# Altium project 远程医疗.PrjPCB
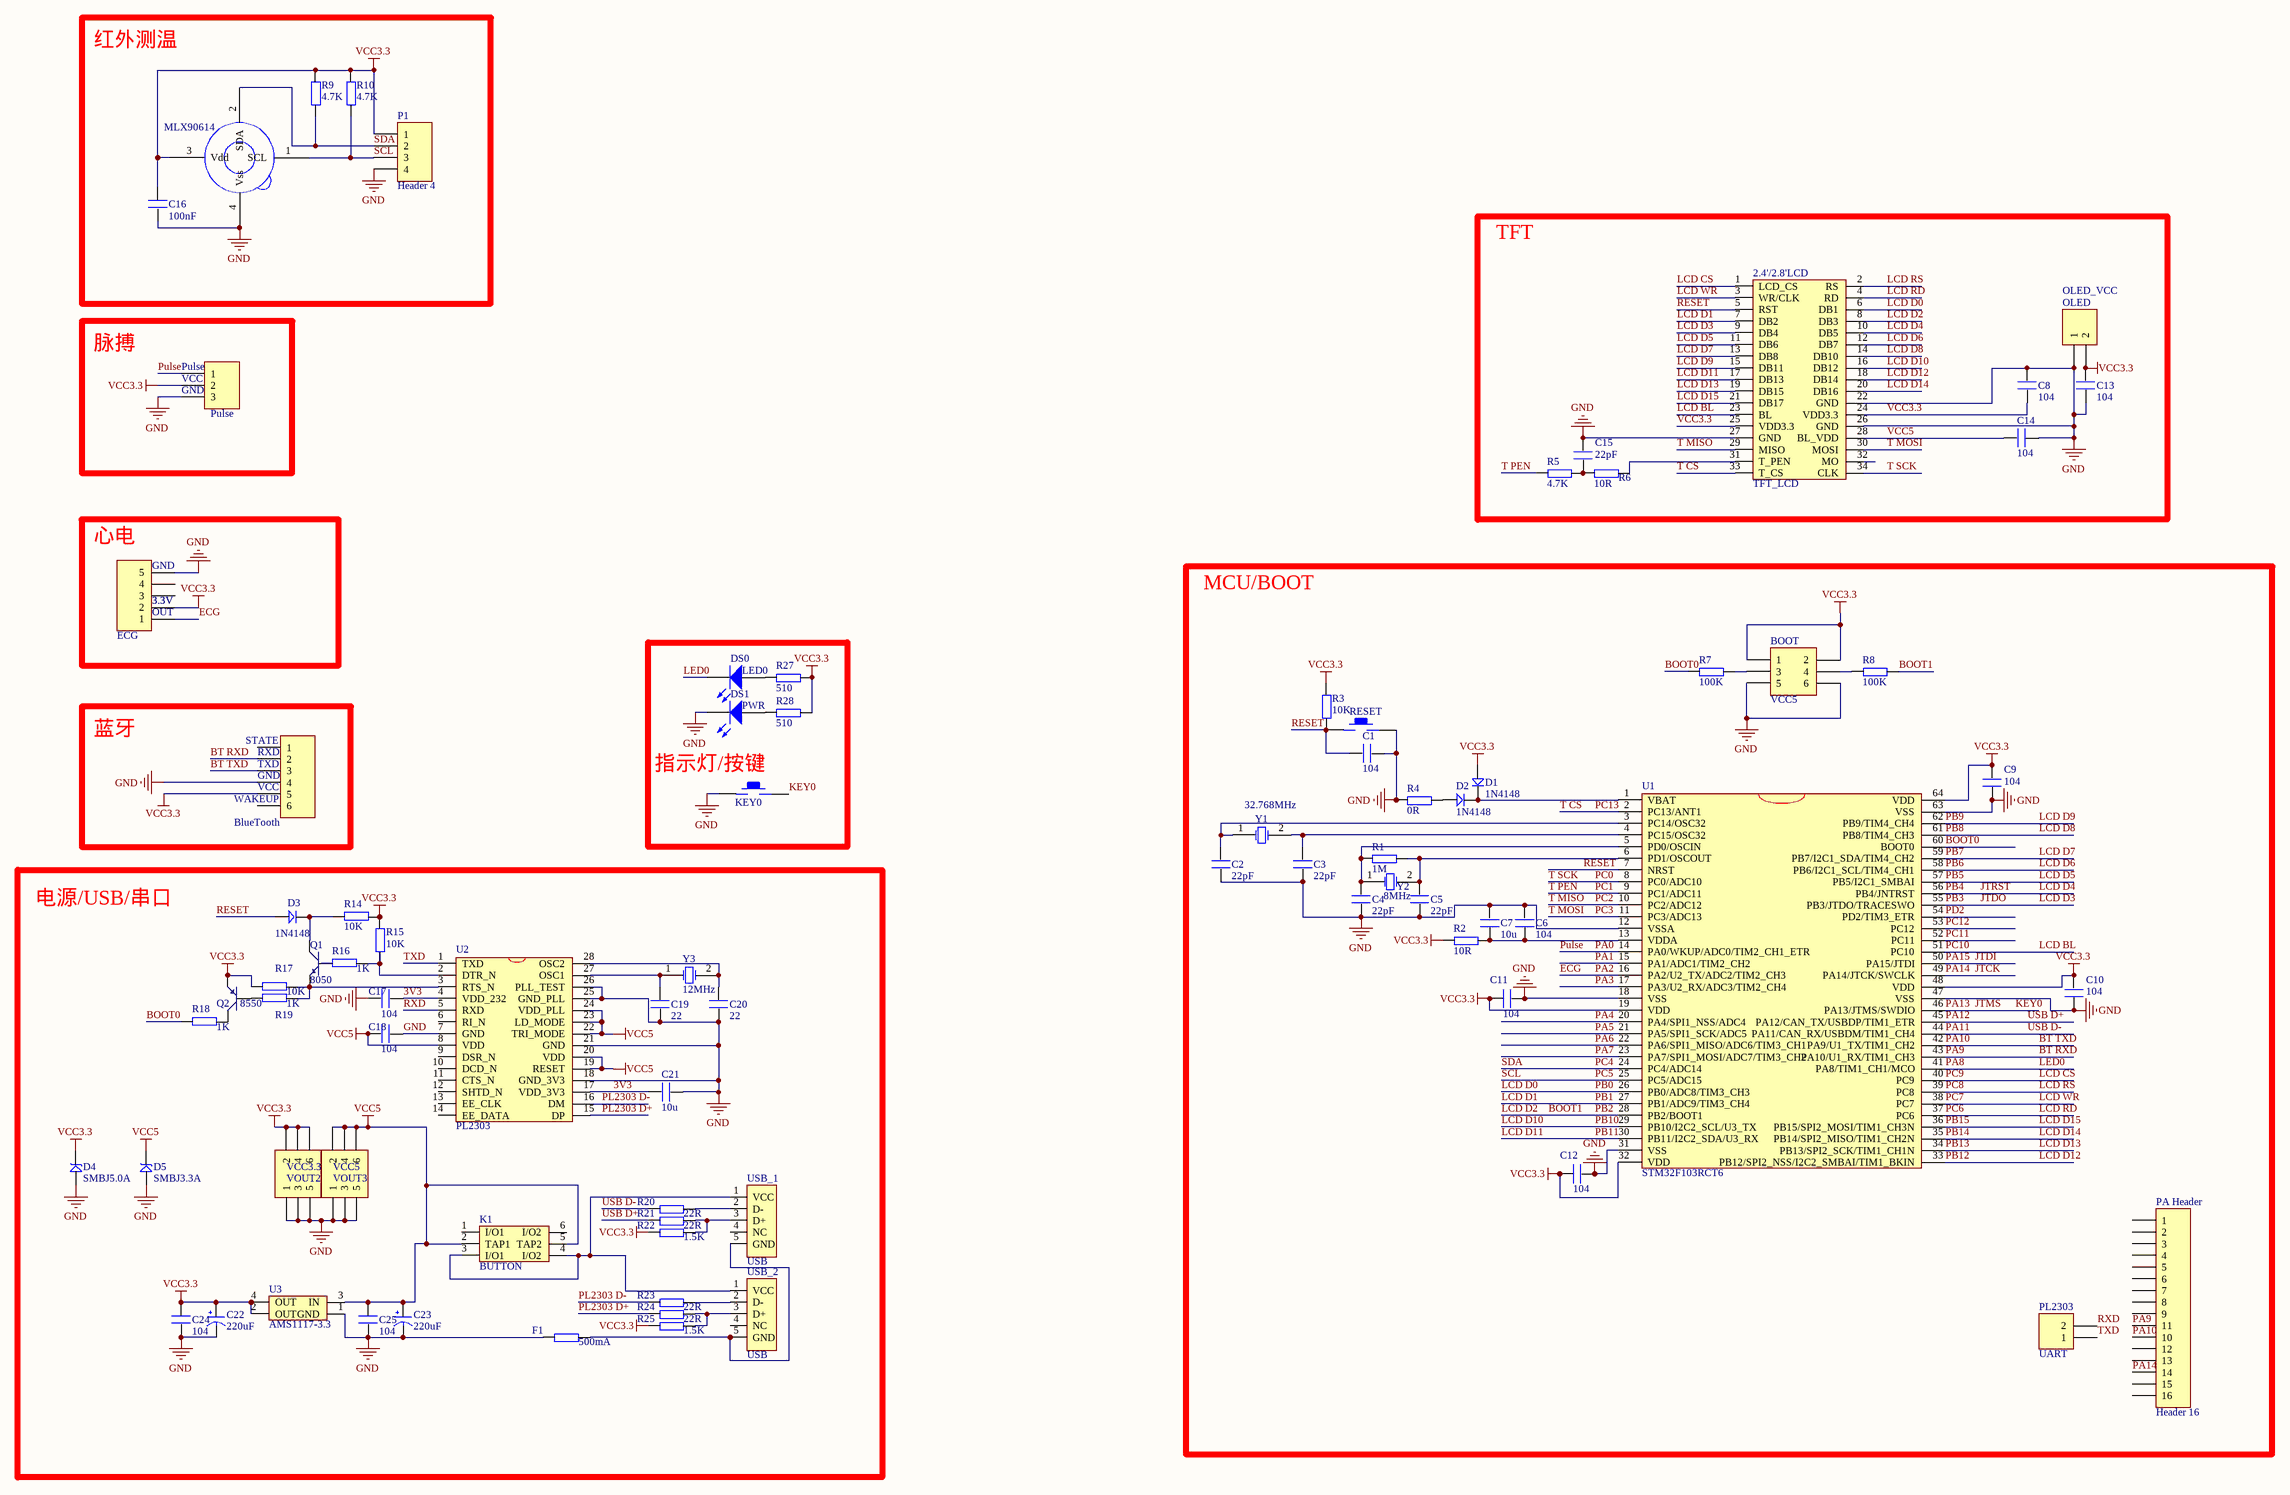
[diagram p0: 远程医疗.SchDoc]
1 sheet, 82 parts. Net scope: global (net labels, ports and power ports of the same name join across sheets).
Board file: 远程医疗完成2014-11-06.PcbDoc

## Sheet 远程医疗.SchDoc
size C

### Parts
2.4'/2.8'LCD  TFT_LCD  [DB2*17]
BlueTooth  BlueTooth  [BlueTooth]  (value not drawn)
BOOT  VCC5  [HDR2X3]
C1  104  [0603P]
C2  22pF  [0603P]
C3  22pF  [0603P]
C4  22pF  [0603P]
C5  22pF  [0603P]
C6  104  [0603P]
C7  10u  [0603P]
C8  104  [0603P]
C9  104  [0603P]
C10  104  [0603P]
C11  104  [0603P]
C12  104  [0603P]
C13  104  [0603P]
C14  104  [0603P]
C15  22pF  [0603P]
C16  100nF  [0603P]
C17  104  [0603P]
C18  104  [0603P]
C19  22  [0603P]
C20  22  [0603P]
C21  10u  [0603P]
C22  220uF  [CC6.56.5]
C23  220uF  [CC6.56.5]
C24  104  [0603P]
C25  104  [0603P]
D1  1N4148  [DIODE_SOP]
D2  1N4148  [DIODE_SOP]
D3  1N4148  [DIODE_SOP]
D4  SMBJ5.0A  [SMBJ]
D5  SMBJ3.3A  [SMBJ]
DS0  LED0  [SMDLED]
DS1  PWR  [SMDLED]
ECG  ECG  [ECG]  (value not drawn)
F1  500mA  [0603P]
K1  BUTTON  [BTN8.5*8.5]
KEY0  KEY_M  [KEY_M]  (value not drawn)
MLX90614  MLX90614  [MLX90614]  (value not drawn)
OLED  OLED_VCC  [HDR1X2]
P1  Header 4  [HDR1X4]
PA_Header  Header 16  [HDR1X16]
PL2303  UART  [HDR1X2]
Pulse  Pulse  [Pulse]  (value not drawn)
Q1  8050  [SOT-23R]
Q2  8550  [SOT-23R]
R1  1M  [0603P]
R2  10R  [0603P]
R3  10K  [0603P]
R4  0R  [0603P]
R5  4.7K  [0603P]
R6  10R  [0603P]
R7  100K  [0603P]
R8  100K  [0603P]
R9  4.7K  [0603P]
R10  4.7K  [0603P]
R14  10K  [0603P]
R15  10K  [0603P]
R16  1K  [0603P]
R17  10K  [0603P]
R18  1K  [0603P]
R19  1K  [0603P]
R20  22R  [0603P]
R21  22R  [0603P]
R22  1.5K  [0603P]
R23  22R  [0603P]
R24  22R  [0603P]
R25  1.5K  [0603P]
R27  510  [0603P]
R28  510  [0603P]
RESET  KEY_M  [KEY_M]  (value not drawn)
U1  STM32F103RCT6  [LQFP64]
U2  PL2303  [ssop28]
U3  AMS1117-3.3  [AMS1117]
USB_1  USB  [USB/SM0.8-6H5]
USB_2  USB  [USB/SM0.8-6H5]
VOUT2  VCC3.3  [HDR2X3]
VOUT3  VCC5  [HDR2X3]
Y1  32.768MHz  [XTAL 32M]
Y2  8MHz  [XTAL_US]
Y3  12MHz  [XTAL_US]

### Blocks framed on the sheet
红外测温: C16 MLX90614 P1 R9 R10
TFT: 2.4'/2.8'LCD C8 C13-C15 OLED R5 R6
脉搏: Pulse
心电: ECG
MCU/BOOT: BOOT C1-C7 C9-C12 D1 D2 PA_Header PL2303 R1-R4 R7 R8 RESET U1 Y1 Y2
指示灯/按键: DS0 DS1 KEY0 R27 R28
蓝牙: BlueTooth
电源/USB/串口: C17-C25 D3-D5 F1 K1 Q1 Q2 R14-R25 U2 U3 USB_1 USB_2 VOUT2 VOUT3 Y3

### Nets
GND: 2.4'/2.8'LCD.22(GND) 2.4'/2.8'LCD.26(GND) 2.4'/2.8'LCD.27(GND) BlueTooth.4 BOOT.5 BOOT.6 C1.1 C2.1 C3.1 C4.1 C5.1 C6.1 C7.1 C8.2 C9.2 C10.2 C11.2 C12.2 C13.1 C14.1 C15.2 C16.1 C17.1 C18.2 C19.1 C20.1 C21.1 C22.2(GND) C23.2(GND) C24.1 C25.1 D4.1 D5.1 DS1.2(K) ECG.5 F1.1 KEY0.1 MLX90614.4(Vss) OLED.1 P1.4 Pulse.3 R4.1 RESET.2 U1.12(VSSA) U1.18(VSS) U1.31(VSS) U1.47(VSS) U1.63(VSS) U2.7(GND) U2.18(GND_3V3) U2.21(GND) U2.25(GND_PLL) U2.26(PLL_TEST) U3.1(GND) VOUT2.1 VOUT2.3 VOUT2.5 VOUT3.1 VOUT3.3 VOUT3.5
VCC3.3: 2.4'/2.8'LCD.24(VDD3.3) 2.4'/2.8'LCD.25(VDD3.3) BlueTooth.5 BOOT.1 BOOT.2 C8.1 C9.1 C10.1 C11.1 C12.1 C13.2 C16.2 C22.1(VCC) C24.2 D1.1 D4.2 ECG.2 MLX90614.3(Vdd) OLED.2 P1.1 Pulse.2 Q2.1(E) R2.1 R3.2 R9.2 R10.2 R14.1 R15.2 R17.2 R22.1 R25.1 R27.2 R28.2 U1.19(VDD) U1.32(VDD) U1.48(VDD) U1.64(VDD) U3.2(OUT) U3.4(OUT) VOUT2.2 VOUT2.4 VOUT2.6
VCC5: 2.4'/2.8'LCD.28(BL_VDD) C14.2 C18.1 C23.1(VCC) C25.2 D5.2 K1.2(TAP1) K1.5(TAP2) U2.8(VDD) U2.19(RESET) U2.20(VDD) U2.22(TRI_MODE) U2.23(LD_MODE) U2.24(VDD_PLL) U3.3(IN) VOUT3.2 VOUT3.4 VOUT3.6
3V3: C17.2 C21.2 U2.4(VDD_232) U2.17(VDD_3V3)
BOOT0: R7.1 R18.2 U1.60(BOOT0)
BOOT1: 2.4'/2.8'LCD.8(DB3) R8.2 U1.28(PB2/BOOT1)  [also labelled LCD D2, PB2]
BT RXD: BlueTooth.2 PA_Header.11 U1.43(PA10/U1_RX/TIM1_CH3)  [also labelled PA9]
BT TXD: BlueTooth.3 PA_Header.10 U1.42(PA9/U1_TX/TIM1_CH2)  [also labelled PA10]
ECG: ECG.1 U1.16(PA2/U2_TX/ADC2/TIM2_CH3)  [also labelled PA2]
JTCK: PA_Header.14 U1.49(PA14/JTCK/SWCLK)  [also labelled PA14]
JTDI: U1.50(PA15/JTDI)  [also labelled PA15]
JTDO: 2.4'/2.8'LCD.9(DB4) U1.55(PB3/JTDO/TRACESWO)  [also labelled LCD D3, PB3]
JTMS: KEY0.2 U1.46(PA13/JTMS/SWDIO)  [also labelled KEY0, PA13]
JTRST: 2.4'/2.8'LCD.10(DB5) U1.56(PB4/JNTRST)  [also labelled LCD D4, PB4]
LCD BL: 2.4'/2.8'LCD.23(BL) U1.51(PC10)  [also labelled PC10]
LCD CS: 2.4'/2.8'LCD.1(LCD_CS) U1.40(PC9)  [also labelled PC9]
LCD D0: 2.4'/2.8'LCD.6(DB1) U1.26(PB0/ADC8/TIM3_CH3)  [also labelled PB0]
LCD D1: 2.4'/2.8'LCD.7(DB2) U1.27(PB1/ADC9/TIM3_CH4)  [also labelled PB1]
LCD D5: 2.4'/2.8'LCD.11(DB6) U1.57(PB5/I2C1_SMBAI)  [also labelled PB5]
LCD D6: 2.4'/2.8'LCD.12(DB7) U1.58(PB6/I2C1_SCL/TIM4_CH1)  [also labelled PB6]
LCD D7: 2.4'/2.8'LCD.13(DB8) U1.59(PB7/I2C1_SDA/TIM4_CH2)  [also labelled PB7]
LCD D8: 2.4'/2.8'LCD.14(DB10) U1.61(PB8/TIM4_CH3)  [also labelled PB8]
LCD D9: 2.4'/2.8'LCD.15(DB11) U1.62(PB9/TIM4_CH4)  [also labelled PB9]
LCD D10: 2.4'/2.8'LCD.16(DB12) U1.29(PB10/I2C2_SCL/U3_TX)  [also labelled PB10]
LCD D11: 2.4'/2.8'LCD.17(DB13) U1.30(PB11/I2C2_SDA/U3_RX)  [also labelled PB11]
LCD D12: 2.4'/2.8'LCD.18(DB14) U1.33(PB12/SPI2_NSS/I2C2_SMBAI/TIM1_BKIN)  [also labelled PB12]
LCD D13: 2.4'/2.8'LCD.19(DB15) U1.34(PB13/SPI2_SCK/TIM1_CH1N)  [also labelled PB13]
LCD D14: 2.4'/2.8'LCD.20(DB16) U1.35(PB14/SPI2_MISO/TIM1_CH2N)  [also labelled PB14]
LCD D15: 2.4'/2.8'LCD.21(DB17) U1.36(PB15/SPI2_MOSI/TIM1_CH3N)  [also labelled PB15]
LCD RD: 2.4'/2.8'LCD.4(RD) U1.37(PC6)  [also labelled PC6]
LCD RS: 2.4'/2.8'LCD.2(RS) U1.39(PC8)  [also labelled PC8]
LCD WR: 2.4'/2.8'LCD.3(WR/CLK) U1.38(PC7)  [also labelled PC7]
LED0: DS0.2(K) U1.41(PA8/TIM1_CH1/MCO)  [also labelled PA8]
PA0: Pulse.1 U1.14(PA0/WKUP/ADC0/TIM2_CH1_ETR)  [also labelled Pulse]
PA1: U1.15(PA1/ADC1/TIM2_CH2)
PA3: U1.17(PA3/U2_RX/ADC3/TIM2_CH4)
PA4: U1.20(PA4/SPI1_NSS/ADC4)
PA5: U1.21(PA5/SPI1_SCK/ADC5)
PA6: U1.22(PA6/SPI1_MISO/ADC6/TIM3_CH1)
PA7: U1.23(PA7/SPI1_MOSI/ADC7/TIM3_CH2)
PA11: R20.1 U1.44(PA11/CAN_RX/USBDM/TIM1_CH4)  [also labelled USB D-]
PA12: R21.1 U1.45(PA12/CAN_TX/USBDP/TIM1_ETR)  [also labelled USB D+]
PC0: 2.4'/2.8'LCD.34(CLK) U1.8(PC0/ADC10)  [also labelled T SCK]
PC1: R5.1 U1.9(PC1/ADC11)  [also labelled T PEN]
PC2: 2.4'/2.8'LCD.29(MISO) U1.10(PC2/ADC12)  [also labelled T MISO]
PC3: 2.4'/2.8'LCD.30(MOSI) U1.11(PC3/ADC13)  [also labelled T MOSI]
PC4: MLX90614.2(SDA) P1.2 R9.1 U1.24(PC4/ADC14)  [also labelled SDA]
PC5: MLX90614.1(SCL) P1.3 R10.1 U1.25(PC5/ADC15)  [also labelled SCL]
PC11: U1.52(PC11)
PC12: U1.53(PC12)
PC13: 2.4'/2.8'LCD.33(T_CS) U1.2(PC13/ANT1)  [also labelled T CS]
PD2: U1.54(PD2/TIM3_ETR)
PL2303 D+: R24.1 U2.15(DP)
PL2303 D-: R23.1 U2.16(DM)
RESET: 2.4'/2.8'LCD.5(RST) C1.2 D3.1 R3.1 RESET.1 U1.7(NRST)
RXD: PL2303.2 U2.5(RXD)
TXD: PL2303.1 U2.1(TXD)
Net2.4'/2.8'LCD_31: 2.4'/2.8'LCD.31(T_PEN) R6.2
NetBOOT_3: BOOT.3 R7.2
NetBOOT_4: BOOT.4 R8.1
NetC2_2: C2.2 U1.3(PC14/OSC32) Y1.1(OSC1)
NetC3_2: C3.2 U1.4(PC15/OSC32) Y1.2(OSC2)
NetC4_2: C4.2 R1.1 U1.5(PD0/OSCIN) Y2.1(OSC1)
NetC5_2: C5.2 R1.2 U1.6(PD1/OSCOUT) Y2.2(OSC2)
NetC6_2: C6.2 C7.2 R2.2 U1.13(VDDA)
NetC15_1: C15.1 R5.2 R6.1
NetC19_2: C19.2 U2.27(OSC1) Y3.1(OSC1)
NetC20_2: C20.2 U2.28(OSC2) Y3.2(OSC2)
NetD1_2: D1.2 D2.2 U1.1(VBAT)
NetD2_1: D2.1 R4.2
NetD3_2: D3.2 Q1.3(C) R14.2
NetDS0_1: DS0.1(A) R27.1
NetDS1_1: DS1.1(A) R28.1
NetF1_2: F1.2 USB_1.5(GND) USB_2.5(GND)
NetK1_3: K1.3(I/O1) K1.4(I/O2) USB_1.1(VCC) USB_2.1(VCC)
NetQ1_1: Q1.1(E) R17.1 R19.1 U2.3(RTS_N)
NetQ1_2: Q1.2(B) R16.2
NetQ2_2: Q2.2(B) R19.2
NetQ2_3: Q2.3(C) R18.1
NetR15_1: R15.1 R16.1 U2.2(DTR_N)
NetR20_2: R20.2 USB_1.2(D-)
NetR21_2: R21.2 R22.2 USB_1.3(D+)
NetR23_2: R23.2 USB_2.2(D-)
NetR24_2: R24.2 R25.2 USB_2.3(D+)

Not connected (* = marked no-connect by the designer): 2.4'/2.8'LCD 32(MO); BlueTooth 1 6; ECG 3 4; K1 1(I/O1) 6(I/O2); PA_Header 1 2 3 4 5 6 7 8 9 12 13 15 16; U2 6(RI_N) 9(DSR_N) 10(DCD_N) 11(CTS_N) 12(SHTD_N) 13(EE_CLK) 14(EE_DATA); USB_1 4(NC); USB_2 4(NC)

### Notes on the sheet
- (in symbol BlueTooth) STATE; RXD; TXD; GND; VCC; WAKEUP
- (in symbol ECG) GND; 3.3V; OUT
- (in symbol Pulse) VCC; GND

### Library data of the parts
BOOT VOUT2 VOUT3 = Header 3X2: Header, 3-Pin, Dual row; LatestRevisionDate: 17-Jul-2002; LatestRevisionNote: Re-released for DXP Platform.; Publisher: Altium Limited
C1-C21 C24 C25 = C
C22 C23 = CAP
D1-D3 = D
D4 D5 = SMBJ: TVS
DS0 DS1 = LED2: Typical RED, GREEN, YELLOW, AMBER GaAs LED; Published: 8-Jun-2000; LatestRevisionDate: 17-Jul-2002; LatestRevisionNote: Re-released for DXP Platform.; PackageDocument: Feb-2002; PackageReference: 3.2X1.6X1.1; Publisher: Altium Limited
F1 R1-R10 R14-R25 R27 R28 = R
OLED PL2303 = Header 2: Header, 2-Pin; LatestRevisionDate: 17-Jul-2002; LatestRevisionNote: Re-released for DXP Platform.; Publisher: Altium Limited
P1 = Header 4: Header, 4-Pin; LatestRevisionDate: 17-Jul-2002; LatestRevisionNote: Re-released for DXP Platform.; Publisher: Altium Limited
PA_Header = Header 16: Header, 16-Pin; LatestRevisionDate: 17-Jul-2002; LatestRevisionNote: Re-released for DXP Platform.; Publisher: Altium Limited
Q1 = NPN: 8050/BCW846/BCW847
Q2 = PNP: 8550/BCW68
U1 = STM32F103RBT6
U3 = AMS1117
USB_1 USB_2 = USB5
Y1-Y3 = XTAL: Crystal Oscillator; Published: 8-Jun-2000; LatestRevisionDate: 17-Jul-2002; LatestRevisionNote: Re-released for DXP Platform.; Publisher: Altium Limited